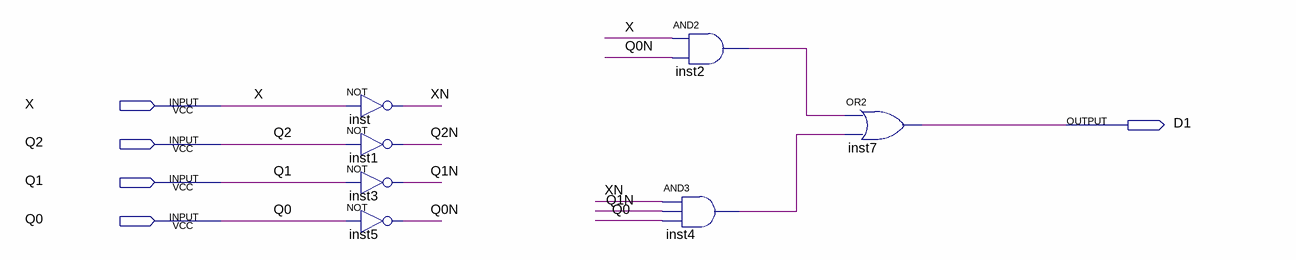
[diagram p0: schematic sheet]
// Quartus schematic D1.bdf as structural Verilog: 7 symbols, 5 pins
module D1 (
  input  X,
  input  Q2,
  input  Q1,
  input  Q0,
  output D1
);

  wire inst2_out, inst4_out, Q0N, Q1N, Q2N, XN;

  not inst (XN, X);
  not inst1 (Q2N, Q2);
  not inst3 (Q1N, Q1);
  not inst5 (Q0N, Q0);
  and inst2 (inst2_out, X, Q0N);
  and inst4 (inst4_out, XN, Q1N, Q0);
  or inst7 (D1, inst2_out, inst4_out);
endmodule
